# Altium schematic sheet Telemetry.SchDoc
size 420 x 297 mm; SheetNumber: 5; SheetTotal: 7
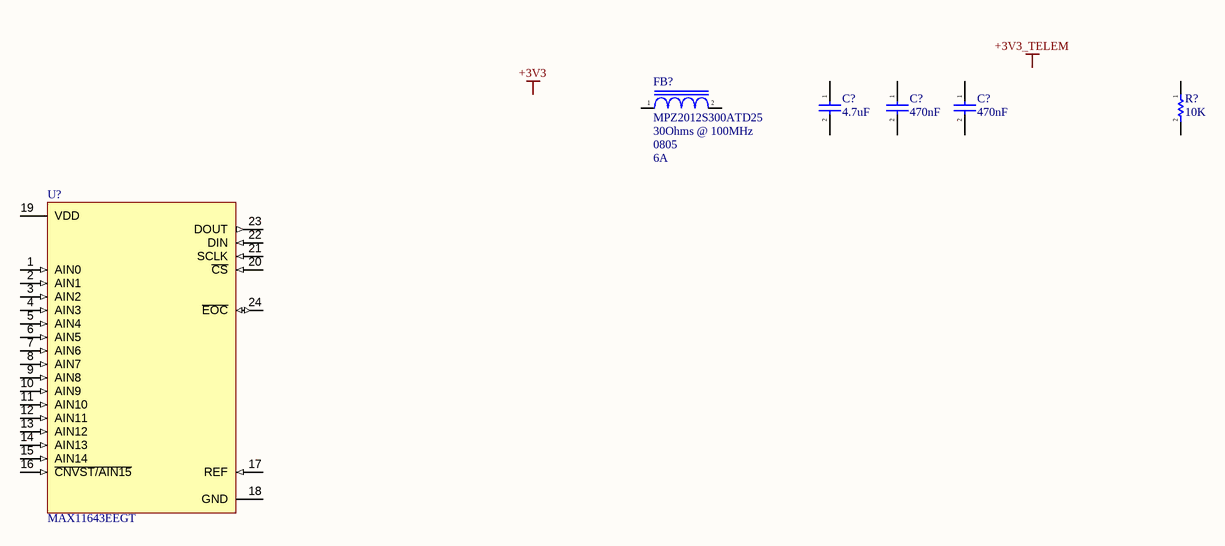
[diagram p0: Telemetry.SchDoc]

## Parts
(Parts that share a designator on the sheet are numbered #1, #2 ... from top to bottom, then left to right.)
C?#1  4.7uF  [CAP_0805]
C?#2  470nF  [CAP_0402]
C?#3  470nF  [CAP_0402]
FB?  MPZ2012S300ATD25  Impedance @ Freq: 30Ohms @ 100MHz  Package / Case: 0805  Current Rating: 6A  [IND_0805]
R?  10K  [RES_0603]
U?  MAX11643EEGT  [MAX11643EEG+]

## Nets

Not connected (* = marked no-connect by the designer): C?#1 1 2; C?#2 1 2; C?#3 1 2; FB? 1 2; R? 1 2; U? 1(AIN0) 2(AIN1) 3(AIN2) 4(AIN3) 5(AIN4) 6(AIN5) 7(AIN6) 8(AIN7) 9(AIN8) 10(AIN9) 11(AIN10) 12(AIN11) 13(AIN12) 14(AIN13) 15(AIN14) 16(~{CNVST/AIN15}) 17(REF) 18(GND) 19(VDD) 20(~{CS}) 21(SCLK) 22(DIN) 23(DOUT) 24(~{EOC})

## Notes on the sheet
- Labels drawn without touching a wire or pin: +3V3, +3V3_TELEM
- PROJECT
- TITLE
- FILE NAME
- A3
- SIZE
- DWG NO.
- SHEET
- OF
- REV

## Library data of the parts
C?#1-C?#3 = CAP_CER: Generic SMT Ceramic Capacitor; Voltage - Rated: 25V; Operating Temperature: *; Tolerance: *; Mfr: *; ComponentLink1Description: Digikey; ComponentLink1URL: [Digikey Link]; Digikey Part No: *; ComponentLink2Description: Datasheet; ComponentLink2URL: [Datasheet Link]
  C?#1: Footprint: 0805
  C?#2 C?#3: Footprint: 0402
FB? = IND_MPZ2012S300ATD25: 30 Ohms @ 100 MHz 1 Power Line Ferrite Bead 0805 (2012 Metric) 6A 10mOhm; Resistance: 10mOhms; Operating Temperature: -55C - 125C; Rating: AEC-Q200
R? = RESISTOR: Power: 1/16W; Tolerance: 10%; Automotive: *; Operating Temperature: *; # Digikey: *; ComponentLink1Description: Digikey; ComponentLink1URL: *; # Manufacturer: *; Package / Case: 0603
U? = IC_MAX11643EEGT: 8 Bit Analog to Digital Converter 16 Input 1 SAR 24-QSOP; Mfr: Maxim Integrated; Number of Bits: 8; Sampling rate: 300k; Number of inputs: 16; Input Type: Single Ended; Internal Reference: 2.5V; Internal Clock: 4.4MHz; Voltage Supply: 2.7V - 3.6V; Operating Temperature: -40C to 85C; Supplier 1: Mouser; Supplier Part Number 1: 700-MAX11643EEG+; ComponentLink1Description: Digikey; ComponentLink1URL: https://www.digikey.ca/en/products/detail/analog-devices-inc-maxim-integrated/MAX11643EEG/2793247; ComponentLink2Description: Datasheet; ComponentLink2URL: https://datasheets.maximintegrated.com/en/ds/MAX11638-MAX11643.pdf